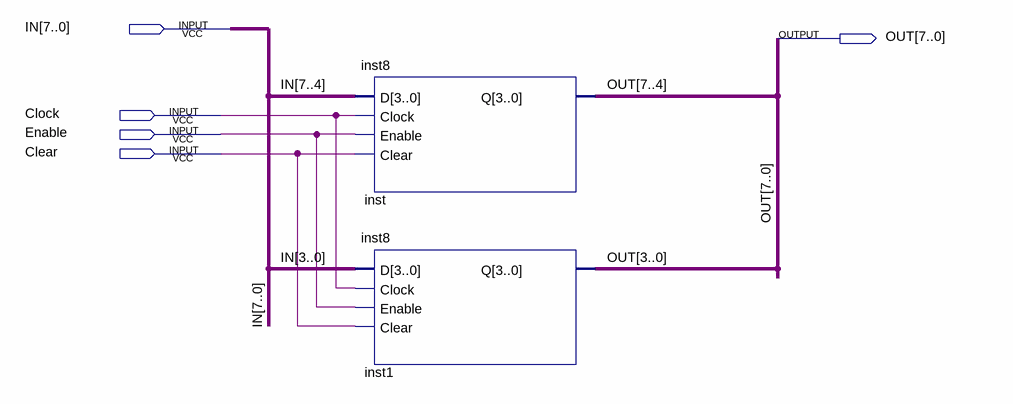
[diagram p0: schematic sheet]
// Quartus schematic V.bdf as structural Verilog: 2 symbols, 5 pins
module V (
  input  [7:0] IN,
  input  Clock,
  input  Enable,
  input  Clear,
  output [7:0] OUT
);

  inst8 inst (.D(IN[7:4]), .Clock(Clock), .Enable(Enable), .Clear(Clear), .Q(OUT[7:4]));
  inst8 inst1 (.D(IN[3:0]), .Clock(Clock), .Enable(Enable), .Clear(Clear), .Q(OUT[3:0]));
endmodule
